# Altium project uz_per_dcdc_converter_adapter.PrjPcb
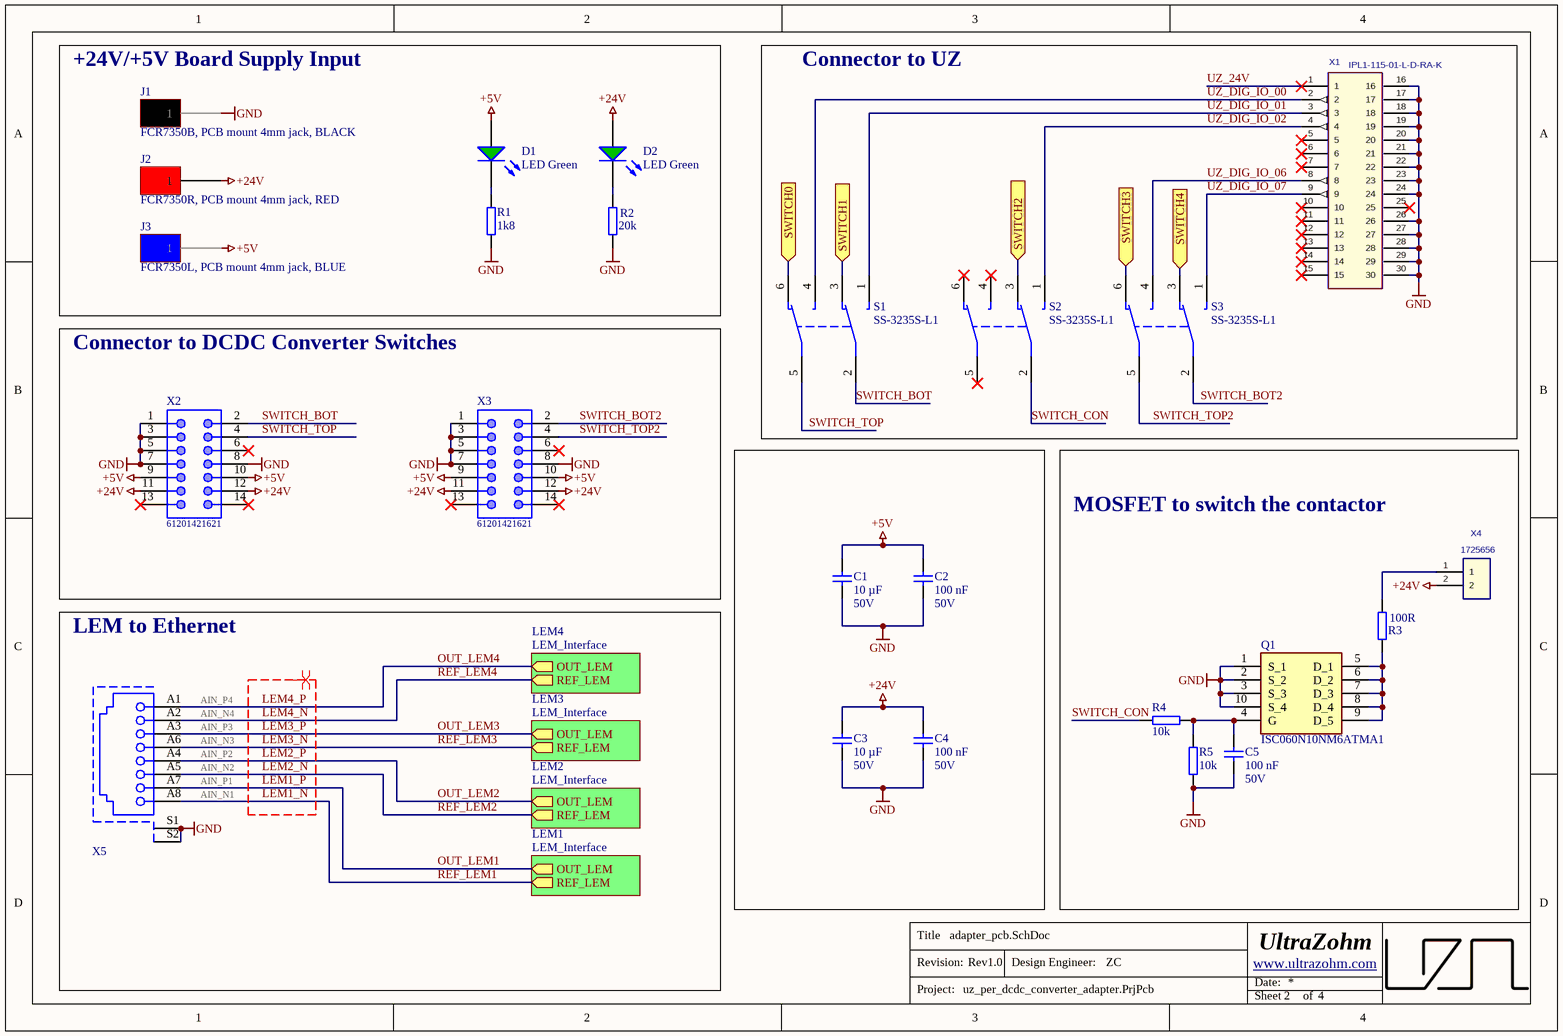
[diagram p0: adapter_pcb.SchDoc]
Author: ZC; AuthorParam: ZC; FinDate: 12/2025; ProjectNameCustom: UZ_PER_dcdc_converter_adapter; ProjectRevision: Rev1.0
2 sheets, 30 parts. Net scope: hierarchical (ports join the sheet entries above them; power ports are global).
Board file: uz_per_dcdc_converter_adapter.PcbDoc
Sheets:
  adapter_pcb.SchDoc
  Optical_RX.SchDoc

## Sheet adapter_pcb.SchDoc
size A4; Organization: UltraZohm; SheetNumber: 2; SheetTotal: 4; Website: www.ultrazohm.com

### Parts
C1  Voltage: 50V  [C_1206_TE]  (hidden comment: 10 µF)
C2  Voltage: 50V  [C_0603_TE]  (hidden comment: 100 nF)
C3  Voltage: 50V  [C_1206_TE]  (hidden comment: 10 µF)
C4  Voltage: 50V  [C_0603_TE]  (hidden comment: 100 nF)
C5  Voltage: 50V  [C_0603_TE]  (hidden comment: 100 nF)
D1  LED Green  [WL-SMCW_0603]
D2  LED Green  [WL-SMCW_0603]
J1  FCR7350B, PCB mount 4mm jack, BLACK  [FCR7350]
J2  FCR7350R, PCB mount 4mm jack, RED  [FCR7350]
J3  FCR7350L, PCB mount 4mm jack, BLUE  [FCR7350]
Q1  ISC060N10NM6ATMA1  [ISC060N10NM6ATMA1]
R1  1k8  [R_0603_TE]
R2  20k  [R_0603_TE]
R3  100R  [R_0603_TE]
R4  10k  [R_0603_TE]
R5  10k  [R_0603_TE]
S1  SS-3235S-L1  [SS-3235S-L1]
S2  SS-3235S-L1  [SS-3235S-L1]
S3  SS-3235S-L1  [SS-3235S-L1]
X1  IPL1-115-01-L-D-RA-K  [IPL1-115-01-XX-D-RA]
X2  61201421621  [61201421621]
X3  61201421621  [61201421621]
X4  1725656  [1725656]
X5  (no value)  [R-RJ45R10P-B000]

### Blocks framed on the sheet
+24V/+5V Board Supply Input: D1 D2 J1-J3 R1 R2
Connector to UZ: S1-S3 X1
Connector to DCDC Converter Switches: X2 X3
MOSFET to switch the contactor: C5 Q1 R3-R5 X4
LEM to Ethernet: X5

### Sub-sheets
LEM1 = LEM_Interface (file not in this document): REF_LEM (out), OUT_LEM (out)
LEM2 = LEM_Interface (file not in this document): REF_LEM (out), OUT_LEM (out)
LEM3 = LEM_Interface (file not in this document): REF_LEM (out), OUT_LEM (out)
LEM4 = LEM_Interface (file not in this document): REF_LEM (out), OUT_LEM (out)

### Ports
SWITCH0 (in, see TopSheet[1A]), SWITCH1 (in, see TopSheet[1A]), SWITCH2 (in, see TopSheet[1A]), SWITCH3 (in, see TopSheet[1B]), SWITCH4 (in, see TopSheet[1B])

### Nets
+5V: C1.2 C2.2 D1.2(A) J3.1 X2.9 X2.10 X3.9 X3.10
+24V: C3.2 C4.2 D2.2(A) J2.1 X2.11 X2.12 X3.11 X3.12 X4.2
GND: C1.1 C2.1 C3.1 C4.1 C5.1 J1.1 Q1.1(S_1) Q1.2(S_2) Q1.3(S_3) Q1.10(S_4) R1.2 R2.2 R5.1 X1.16 X1.17 X1.18 X1.19 X1.20 X1.21 X1.22 X1.23 X1.24 X1.26 X1.27 X1.28 X1.29 X1.30 X2.1 X2.3 X2.5 X2.7 X2.8 X3.1 X3.3 X3.5 X3.7 X3.8 X5.S1 X5.S2
LEM1_N: X5.A8 ; sheet LEM1/REF_LEM  [also labelled REF_LEM1]
LEM1_P: X5.A7 ; sheet LEM1/OUT_LEM  [also labelled OUT_LEM1]
LEM2_N: X5.A5 ; sheet LEM2/REF_LEM  [also labelled REF_LEM2]
LEM2_P: X5.A4 ; sheet LEM2/OUT_LEM  [also labelled OUT_LEM2]
LEM3_N: X5.A6 ; sheet LEM3/REF_LEM  [also labelled REF_LEM3]
LEM3_P: X5.A3 ; sheet LEM3/OUT_LEM  [also labelled OUT_LEM3]
LEM4_N: X5.A2 ; sheet LEM4/REF_LEM  [also labelled REF_LEM4]
LEM4_P: X5.A1 ; sheet LEM4/OUT_LEM  [also labelled OUT_LEM4]
SWITCH_BOT: S1.2(COM1) X2.2
SWITCH_BOT2: S3.2(COM1) X3.2
SWITCH_CON: R4.2 S2.2(COM1)
SWITCH_TOP: S1.5(COM2) X2.4
SWITCH_TOP2: S3.5(COM2) X3.4
UZ_24V: X1.1
UZ_DIG_IO_00: S1.4(NO2) X1.2
UZ_DIG_IO_01: S1.1(NO1) X1.3
UZ_DIG_IO_02: S2.1(NO1) X1.4
UZ_DIG_IO_06: S3.4(NO2) X1.8
UZ_DIG_IO_07: S3.1(NO1) X1.9
NetC5_2: C5.2 Q1.4(G) R4.1 R5.2
NetD1_1: D1.1(K) R1.1
NetD2_1: D2.1(K) R2.1
NetQ1_5: Q1.5(D_1) Q1.6(D_2) Q1.7(D_3) Q1.8(D_4) Q1.9(D_5) R3.2
NetR3_1: R3.1 X4.1
NetS1_3: S1.3(NC1) ; port SWITCH1
NetS1_6: S1.6(NC2) ; port SWITCH0
NetS2_3: S2.3(NC1) ; port SWITCH2
NetS3_3: S3.3(NC1) ; port SWITCH4
NetS3_6: S3.6(NC2) ; port SWITCH3

Not connected (* = marked no-connect by the designer): S2 4(NO2)* 5(COM2)* 6(NC2)*; X1 5* 6* 7* 10* 11* 12* 13* 14* 15* 25*; X2 6* 13* 14*; X3 6* 13* 14*

### Layout directives
differential pair: LEM1_N, LEM1_P, LEM2_N, LEM2_P, LEM3_N, LEM3_P, LEM4_N, LEM4_P

### Notes on the sheet
- (near X5) AIN_P4
- (near X5) AIN_N4
- (near X5) AIN_P3
- (near X5) AIN_N3
- (near X5) AIN_P2
- (near X5) AIN_N2
- (near X5) AIN_P1
- (near X5) AIN_N1
- Title
- Revision:
- Design Engineer:
- Date:
- Project:
- Sheet
- of

### Library data of the parts
C1 C3 = UZgen_C_1206_10uF_50V_X7R: Generic capacitor; Manufacturer: UZgen; Tolerance: 10 %; Created from: MGeier; Manufacturer Part Number: UZgen_C_1206_10uF_50V_X7R; PartID: 5807; Created On: 20.03.2025 14:05:00; Value: 10 µF; Device Package: 1206; Technology: X7R; Mounting Type: SMD; Last Updated: 20.03.2025 14:05:00
C2 C4 C5 = UZgen_C_0603_100nF_50V_X7R: Generic capacitor; Manufacturer: UZgen; Tolerance: 10 %; Created from: AGeiger; Manufacturer Part Number: UZgen_C_0603_100nF_50V_X7R; PartID: 1; Created On: 02.07.2024 14:42:23; Value: 100 nF; Device Package: 0603; Technology: X7R; Mounting Type: SMD; Last Updated: 08.08.2024 15:01:15
D1 D2 = 19-217/GHC-YR1S2/3T: LED GREEN 520~535NM 112~258MCD@20MA TOP VIEW 0603 ROHS; Manufacturer: Everlight Elec; Type: Standard; Created from: T. Wendt; Forward Current I_f: 20 mA; Forward Voltage U_f: 3.3 V; Wavelength: 530 nm; Light Intensity: 285 mcd; Nominal Power: 83 mW; Manufacturer Part Number: 19-217/GHC-YR1S2/3T; PartID: 7; Created On: 03.03.2021 10:06:23; ComponentLink1Description: Datasheet; ComponentLink1URL: https://datasheet.lcsc.com/szlcsc/Everlight-Elec-19-217-GHC-YR1S2-3T_C72043.pdf; Component Type: LED Diode; Device Package: 0603; Last Updated: 04.03.2021 09:02:49; Mounting Type: SMD; Operating Temperature: -40 - 85 °C; Supplier 1: LCSC; Supplier Part Number 1: C72043; Supplier 2: Mouser; Supplier Part Number 2: 638-19217GHCYR1S23T; Live Cycle Status: 1; Stock number: not stored; Color: green; LCSC Part Number: C72043
J1 = FCR7350B: FCR7350B, 1000V, 24A, BLACK; Manufacturer: Cliff; Value: PCB mount 4mm jack, Black	FCR7350B, 1000V, 24A; Created from: DHufnagel; Manufacturer Part Number: FCR7350B; PartID: 6; Created On: 13.06.2022 10:18:11; ComponentLink1Description: datasheet; ComponentLink1URL: https://www.cliffuk.co.uk/products/testleads/sockets/S16NPC.pdf; ComponentLink2Description: drawing; ComponentLink2URL: https://media.digikey.com/pdf/Data%20Sheets/Cliff%20Electronic%20LTD%20PDF's/FCR7350_Drawing.pdf; Component Type: PCB mount 4mm jack, Black; Device Package: THT; Last Updated: 21.02.2024 15:21:29; Minimum Order: 1; Mounting Type: THT; Operating Temperature: -40°C - 80°C; Series: S16N-PC; Supplier 1: Digi-Key; Supplier Part Number 1: 3185-FCR7350B-ND; Supplier 2: farnell; Supplier Part Number 2: 1854507; Supplier 3: LCSC; Supplier Part Number 3: C7437327; Type: PCB mount 4mm jack, Black	FCR7350B, 1000V, 24A; Live Cycle Status: 1; LCSC Part Number: C7437327; Stock number: not stored
J2 = FCR7350R: FCR7350B, 1000V, 24A, RED; Manufacturer: Cliff; Value: PCB mount 4mm jack, Red FCR7350R, 1000V, 24A; Created from: DHufnagel; Manufacturer Part Number: FCR7350R; PartID: 7; Created On: 13.06.2022 10:18:11; ComponentLink1Description: datasheet; ComponentLink1URL: https://www.cliffuk.co.uk/products/testleads/sockets/S16NPC.pdf; ComponentLink2Description: drawing; ComponentLink2URL: https://media.digikey.com/pdf/Data%20Sheets/Cliff%20Electronic%20LTD%20PDF's/FCR7350_Drawing.pdf; Component Type: PCB mount 4mm jack, Red; Device Package: THT; Last Updated: 21.02.2024 15:19:13; Minimum Order: 1; Mounting Type: THT; Operating Temperature: -40°C - 80°C; Series: S16N-PC; Supplier 1: Digi-Key; Supplier Part Number 1: 3185-FCR7350R-ND; Supplier 2: farnell; Supplier Part Number 2: 1854508; Supplier 3: LCSC; Supplier Part Number 3: C7437326; Type: PCB mount 4mm jack, Red FCR7350R, 1000V, 24A; Live Cycle Status: 1; LCSC Part Number: C7437326; Stock number: not stored
J3 = FCR7350L: FCR7350B, 1000V, 24A, BLUE; Manufacturer: Cliff; Value: PCB mount 4mm jack, Blue FCR7350L, 1000V, 24A; Created from: DHufnagel; Manufacturer Part Number: FCR7350L; PartID: 8; Created On: 13.06.2022 10:18:11; ComponentLink1Description: datasheet; ComponentLink1URL: https://www.cliffuk.co.uk/products/testleads/sockets/S16NPC.pdf; ComponentLink2Description: drawing; ComponentLink2URL: https://media.digikey.com/pdf/Data%20Sheets/Cliff%20Electronic%20LTD%20PDF's/FCR7350_Drawing.pdf; Component Type: PCB mount 4mm jack, Blue; Device Package: THT; Last Updated: 28.06.2022 13:58:37; Minimum Order: 1; Mounting Type: THT; Operating Temperature: -40°C - 80°C; Series: S16N-PC; Supplier 1: Digi-Key; Supplier Part Number 1: 3185-FCR7350L-ND; Supplier 2: farnell; Supplier Part Number 2: 1854511; Type: PCB mount 4mm jack, Blue FCR7350L, 1000V, 24A; Live Cycle Status: 1; Stock number: not stored
Q1 = ISC060N10NM6ATMA1: Power MOSFET, n-Channel, 97A, 100V; Manufacturer: Infineon Technologies; Value: 100V, 97A; Created from: DHufnagel; Manufacturer Part Number: ISC060N10NM6ATMA1; PartID: 3; Created On: 28.06.2022 07:55:49; ComponentLink1Description: Datasheet; ComponentLink1URL: https://www.mouser.de/datasheet/2/196/Infineon_ISC060N10NM6_DataSheet_v02_00_EN-2942434.pdf; Component Type: Power MOSFET; Device Package: PG-TDSON-8 FL; Last Updated: 14.08.2025 11:41:50; Mounting Type: SMD; Operating Temperature: -55 to +175 °C; Series: ISC060N10; Supplier 1: Mouser; Supplier Part Number 1: 726-ISC060N10NM6ATMA; Supplier 2: RS-online; Supplier Part Number 2: 235-4869; Supplier 3: LCSC; Supplier Part Number 3: C3288847; Type: Power MOSFET; Live Cycle Status: 1; LCSC Part Number: C3288847; Stock number: not stored
R1 = UZgen_R_0603_1k8: Generic resistor; Manufacturer: UZgen; Tolerance: 1 %; Created from: UZgenTool; Manufacturer Part Number: UZgen_R_0603_1k8; PartID: 227; Created On: 02.07.2024 17:29:49; Value: 1k8; Device Package: 0603; Mounting Type: SMD; Last Updated: 02.07.2024 17:29:49; LCSC Part Number: C4177
R2 = UZgen_R_0603_20k: Generic resistor; Manufacturer: UZgen; Tolerance: 1 %; Created from: UZgenTool; Manufacturer Part Number: UZgen_R_0603_20k; PartID: 251; Created On: 02.07.2024 17:29:50; Value: 20k; Device Package: 0603; Mounting Type: SMD; Last Updated: 02.07.2024 17:29:50
R3 = UZgen_R_0603_100R: Generic resistor; Manufacturer: UZgen; Tolerance: 1 %; Created from: UZgenTool; Manufacturer Part Number: UZgen_R_0603_100R; PartID: 197; Created On: 02.07.2024 17:29:48; Value: 100R; Device Package: 0603; Mounting Type: SMD; Last Updated: 02.07.2024 17:29:48
R4 R5 = UZgen_R_0603_10k: Generic resistor; Manufacturer: UZgen; Tolerance: 1 %; Created from: AGeiger; Manufacturer Part Number: UZgen_R_0603_10k; PartID: 1; Created On: 02.07.2024 14:34:53; Value: 10k; Device Package: 0603; Mounting Type: SMD; Last Updated: 02.07.2024 14:37:16; LCSC Part Number: C25804
S1-S3 = SS-3235S-L1: 50mA Horizontal attachment DPDT 12V 12V 50mA 10,000 times Black SMD Slide Switches ROHS; Manufacturer: XKB Connection; Created from: AGeiger; Manufacturer Part Number: SS-3235S-L1; PartID: 49; Created On: 21.02.2024 17:10:55; ComponentLink1Description: Datasheet; ComponentLink1URL: https://www.lcsc.com/datasheet/lcsc_datasheet_2110111230_XKB-Connection-SS-3235S-L1_C500055.pdf; Component Type: Switch DPDT; Device Package: SMD; Last Updated: 23.08.2024 11:42:29; Mounting Type: SMD; Operating Temperature: -40 to +85 °C; Supplier 1: LCSC; Supplier Part Number 1: C500055; Type: Switch; Value: DPDT; Live Cycle Status: 1; LCSC Part Number: C500055
X1 = IPL1-115-01-L-D-RA-K: Terminal Assembly, Double Row, Right Angle, Thru-Hole, 2.54 mm x 2.54 mm Pitch, 30 Pins; Manufacturer: SAMTEC; Created from: TWendt; Number of positions: 30; Manufacturer Part Number: IPL1-115-01-L-D-RA-K; PartID: 34; Created On: 12.02.2021 15:31:18; ComponentLink1Description: Homepage; ComponentLink1URL: https://www.samtec.com/products/ipl1; Component Type: Samtec Connector; Device Package: Connector; Last Updated: 25.01.2024 19:08:01; Supplier 1: SAMTEC; Supplier Part Number 1: IPL1-115-01-L-D-RA-K; Type: Connector; Live Cycle Status: 1; Number of rows: 2; LCSC Part Number: C7423882; Stock number: not stored
X2 X3 = 61201421621: 2.54mm Double Row 14-pol Vertical Male Pin Box Header; Manufacturer: Wurth; Created from: TWilfling; Number of positions: 14; Manufacturer Part Number: 61201421621; PartID: 45; Created On: 29.04.2021 14:12:30; ComponentLink1Description: Homepage; ComponentLink1URL: https://www.we-online.de/katalog/de/BHD_2_54_MALE_BOX_HEADER_6120XX21621?sq=61201421621#61201421621; ComponentLink2Description: Datasheet; ComponentLink2URL: https://www.we-online.de/katalog/datasheet/61201421621.pdf; Component Type: Wurth Connector; Device Package: Connector; Last Updated: 29.04.2021 14:52:34; Mounting Type: THT; Supplier 1: Wurth; Supplier Part Number 1: 61201421621; Type: Connector; Live Cycle Status: 1; Number of rows: 2; Stock number: not stored
X4 = 1725656: Fixed Mounting Block, 2 Pins, 2.54mm Pitch; Manufacturer: Phoenix Contact; Created from: MGremer; Number of positions: 2; Manufacturer Part Number: 1725656; PartID: 49; Created On: 08.06.2021 15:54:18; ComponentLink1Description: Datasheet; ComponentLink1URL: https://www.mouser.de/datasheet/2/324/4/1725656-1437410.pdf; Component Type: Phoenix Connector; Device Package: THT; Last Updated: 13.03.2024 09:50:47; Mounting Type: THT; Operating Temperature: -; Series: MPT; Supplier 1: Mouser; Supplier Part Number 1: 651-1725656; Type: Connector; Live Cycle Status: 1; Number of rows: 1; Stock number: not stored
X5 = R-RJ45R10P-B000: RJ45Receptacle 1 Shielded Bend insert Without LED 0℃~+70℃ Plugin Ethernet Connectors / Modular Connectors (RJ45 RJ11) ROHS; Manufacturer: Ckmtw(Shenzhen Cankemeng); Created from: KIlhan; Manufacturer Part Number: R-RJ45R10P-B000; PartID: 57; Created On: 20.03.2025 09:19:07; ComponentLink1Description: Datasheet; ComponentLink1URL: https://jlcpcb.com/api/file/downloadByFileSystemAccessId/8588892085580021760; Last Updated: 18.05.2025 18:44:47; Mounting Type: THT; Operating Temperature: 0 °C to +70 °C; Series: RJ45; Supplier 1: LCSC; Supplier Part Number 1: C386758; Value: R-RJ45R10P-B000; LCSC Part Number: C386758

## Sheet Optical_RX.SchDoc
size A4; Organization: UltraZohm; SheetNumber: 3; SheetTotal: 3; Website: www.ultrazohm.com
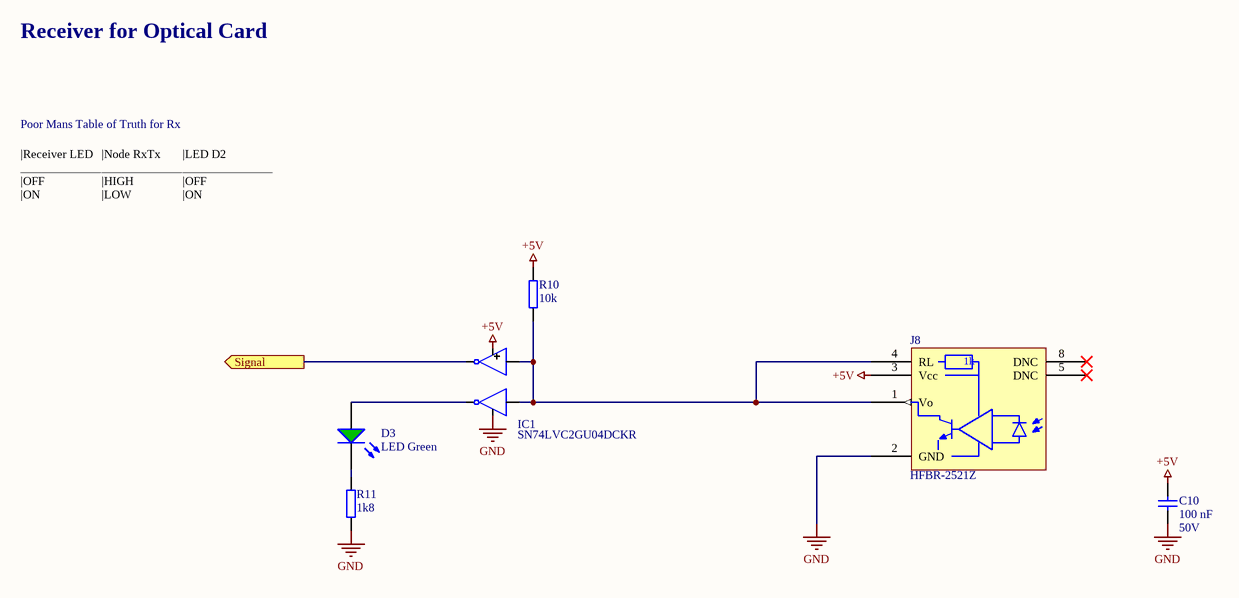
[diagram p1: Optical_RX.SchDoc]

### Parts
C10  Voltage: 50V  [C_0603_TE]  (hidden comment: 100 nF)
D3  LED Green  [WL-SMCW_0603]
IC1  SN74LVC2GU04DCKR  [SN74LVC2GU04DCKR]
J8  HFBR-2521Z  [HFBRx5XX]
R10  10k  [R_0603_TE]
R11  1k8  [R_0603_TE]

### Ports
Signal (out, see TopSheet[2A])

### Nets
+5V: C10.2 IC1.5(VCC) J8.3(Vcc) R10.1
GND: C10.1 IC1.2(GND) J8.2(GND) R11.2
NetD3_1: D3.1(K) R11.1
NetD3_2: D3.2(A) IC1.4(OUT2)
NetIC1_1: IC1.1(IN1) IC1.3(IN2) J8.1(Vo) J8.4(RL) R10.2
NetIC1_6: IC1.6(OUT2) ; port Signal

Not connected (* = marked no-connect by the designer): J8 5(DNC)* 8(DNC)*

### Notes on the sheet
- Receiver for Optical Card
- Poor Mans Table of Truth for Rx
- |Receiver LED
  ________________
  |OFF
  |ON
- |Node RxTx
  _________________
  |HIGH
  |LOW
- |LED D2
  _______________
  |OFF
  |ON
- GATE
  _______
  LOW
  HIGH
- Title
- Revision:
- Design Engineer:
- Date:
- Project:
- Sheet
- of
- (in symbol HFBR-2521Z) 1k

### Library data of the parts
C10 = UZgen_C_0603_100nF_50V_X7R: as C2 on sheet adapter_pcb; Manufacturer Part Number: UZgen_C_0603_100nF_50V_X7R; PartID: 1; Created On: 02.07.2024 14:42:23; Value: 100 nF; Device Package: 0603; Technology: X7R; Mounting Type: SMD; Last Updated: 08.08.2024 15:01:15
D3 = 19-217/GHC-YR1S2/3T: as D1 on sheet adapter_pcb; Manufacturer Part Number: 19-217/GHC-YR1S2/3T; PartID: 7; Created On: 03.03.2021 10:06:23; ComponentLink1Description: Datasheet; ComponentLink1URL: https://datasheet.lcsc.com/szlcsc/Everlight-Elec-19-217-GHC-YR1S2-3T_C72043.pdf; Component Type: LED Diode; Device Package: 0603; Last Updated: 04.03.2021 09:02:49; Mounting Type: SMD; Operating Temperature: -40 - 85 °C; Supplier 1: LCSC; Supplier Part Number 1: C72043; Supplier 2: Mouser; Supplier Part Number 2: 638-19217GHCYR1S23T; Live Cycle Status: 1; Stock number: not stored; Color: green; LCSC Part Number: C72043
IC1 = SN74LVC2GU04DCKR: Dual inverter designed for 1.65-V to 5.5-V VCC operation.; Manufacturer: Texas Instruments; Value: 1.65 - 5.5 V; Created from: N.Diringer; Manufacturer Part Number: SN74LVC2GU04DCKR; PartID: 9; Created On: 18.12.2025 10:20:13; ComponentLink1Description: Datasheet; ComponentLink1URL: https://www.ti.com/product/SN74LVC2GU04; Component Type: Dual Inverter; Device Package: 0603 3-Pin; Last Updated: 18.12.2025 10:20:13; Mounting Type: SMD; Operating Temperature: -40 to 125; Series: SN74LVC2GU04DCKR; Supplier 1: Mouser; Supplier Part Number 1: 595-SN74LVC2GU04DCKR; Supplier 2: LCSC; Supplier Part Number 2: C116660; Type: Inverter; Live Cycle Status: 1; Stock number: not stored; LCSC Part Number: C116660
J8 = HFBR-2521Z: Fibre Optic Receivers, LINK HORIZ 5MBd RC VR RoHS; Suppier Part Number 2: 516-2062-ND; Manufacturer: Broadcom; MF: Boadcom/Avago; Wavelength: 660 nm; Iout max: 25 mA; Supply Voltage: 5V; Created from: VStarost; Created: 2019_04_09_Kreppel; MPN: HFBR-2521Z; Data Rate: 5 MBd; Supplier 1: Mouser; Supplier 2: Digi-Key; Supplier Part Number 1: 630-HFBR-2521Z; Manufacturer Part Number: HFBR-2521Z; PartID: 1; Created On: 27.12.2022 09:44:37; ComponentLink1Description: Datasheet; ComponentLink1URL: https://datasheet.ciiva.com/19453/1584669-19453911.pdf?src-supplier=Jameco; Component Type: LWL Receiver; Device Package: THT; Last Updated: 27.12.2022 09:44:37; Mounting Type: THT; Series: HFBR; Type: LWL Receiver; Live Cycle Status: 1; Stock number: not stored
R10 = UZgen_R_0603_10k: as R4 on sheet adapter_pcb; Manufacturer Part Number: UZgen_R_0603_10k; PartID: 1; Created On: 02.07.2024 14:34:53; Value: 10k; Device Package: 0603; Mounting Type: SMD; Last Updated: 02.07.2024 14:37:16; LCSC Part Number: C25804
R11 = UZgen_R_0603_1k8: as R1 on sheet adapter_pcb; Manufacturer Part Number: UZgen_R_0603_1k8; PartID: 227; Created On: 02.07.2024 17:29:49; Value: 1k8; Device Package: 0603; Mounting Type: SMD; Last Updated: 02.07.2024 17:29:49; LCSC Part Number: C4177

## Nets that join several sheets
+5V: adapter_pcb (8 pins), Optical_RX (C10.2 IC1.5 J8.3 R10.1)
GND: adapter_pcb (39 pins), Optical_RX (C10.1 IC1.2 J8.2 R11.2)